# EAGLE design chromatron_v1.0 (EAGLE 6.6.0)

## Sheet 1 of 2
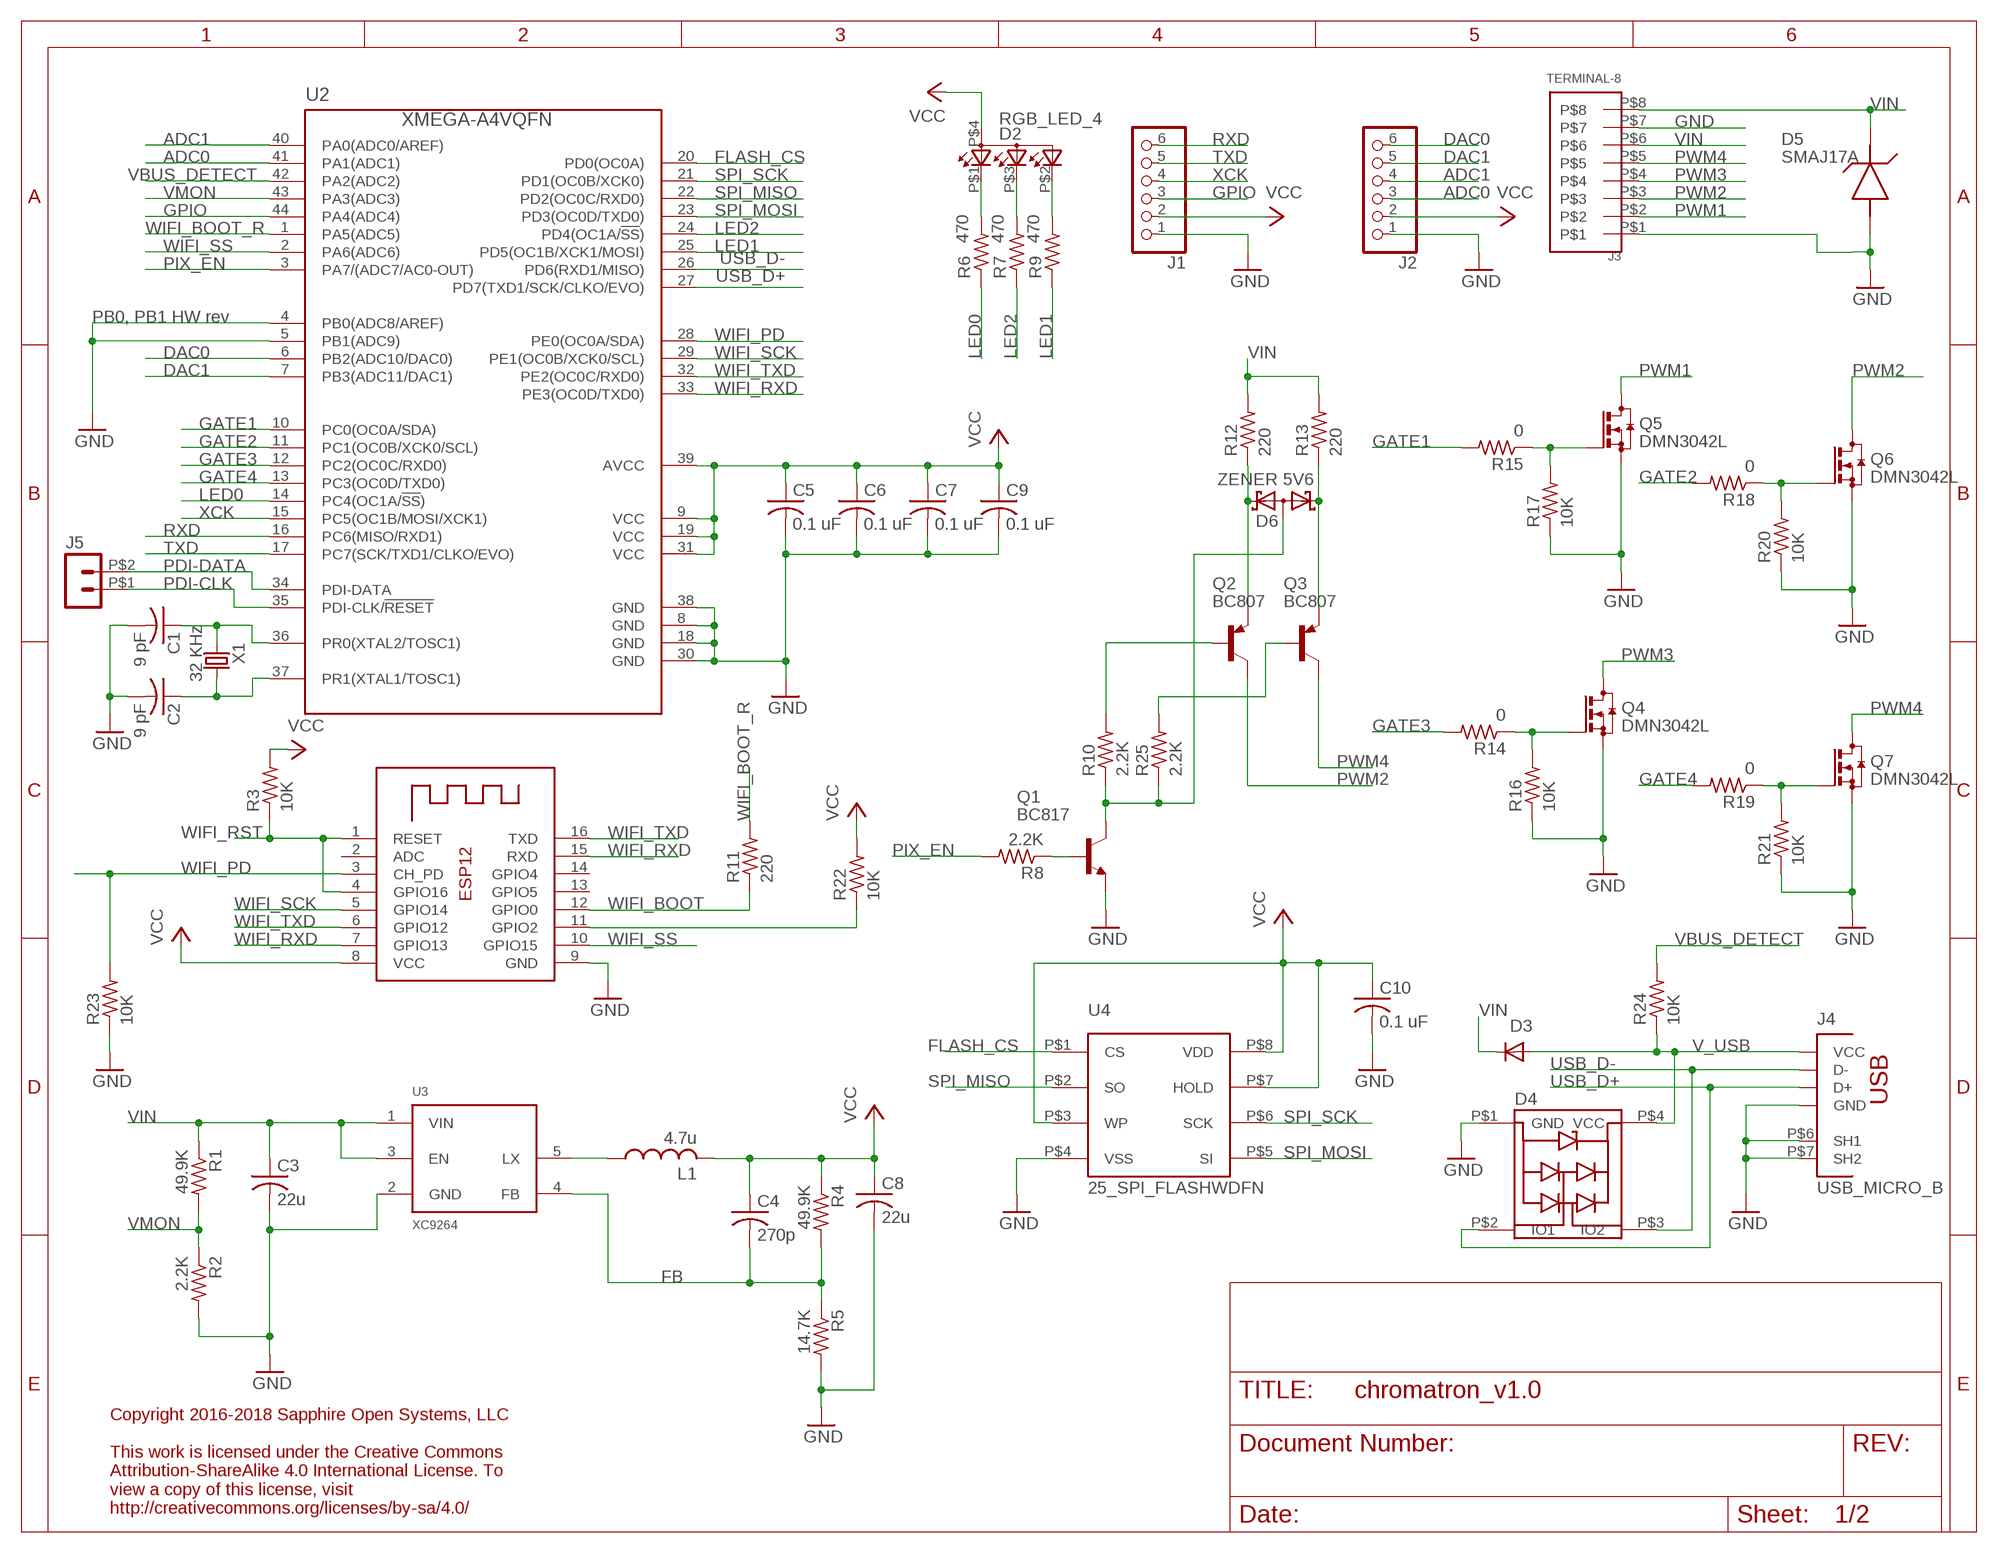
[diagram p0: schematic, sheet 1]

### Parts
C1  9 pF  C-USC0402  [C0402]
C2  9 pF  C-USC0402  [C0402]
C3  22u  C-USC1206  [C1206]
C4  270p  C-USC0402  [C0402]
C5  0.1 uF  C-USC0402  [C0402]
C6  0.1 uF  C-USC0402  [C0402]
C7  0.1 uF  C-USC0402  [C0402]
C8  22u  C-USC1206  [C1206]
C9  0.1 uF  C-USC0402  [C0402]
C10  0.1 uF  C-USC0402  [C0402]
D2  RGB_LED_4  [0606-4]
D3  2A  DIODE_SOD-123FL  [SOD-123FL]
D4  PTRTR5V0U2X  [SOT-143B]
D5  SMAJ17A  SMA_TVS  [SMA]
D6  ZENER 5V6  BAT54A  [SOT23]
J1  PINHD-1X6  [1X06]
J2  PINHD-1X6  [1X06]
J3  TERMINAL-8  [TERMINAL-8]
J4  USB_MICRO_B  [USB-MICRO-B]
J5  PIN_HEADER_1X2  [PIN_HEADER_1X2]
L1  4.7u  L-USL2012C  [L2012C]
Q1  BC817  NPN  [SOT23]
Q2  BC807  PNP  [SOT23]
Q3  BC807  PNP  [SOT23]
Q4  DMN3042L  BSS123  [SOT23]
Q5  DMN3042L  BSS123  [SOT23]
Q6  DMN3042L  BSS123  [SOT23]
Q7  DMN3042L  BSS123  [SOT23]
R1  49.9K  R-US_R0402  [R0402]
R2  2.2K  R-US_R0402  [R0402]
R3  10K  R-US_R0402  [R0402]
R4  49.9K  R-US_R0402  [R0402]
R5  14.7K  R-US_R0402  [R0402]
R6  470  R-US_R0402  [R0402]
R7  470  R-US_R0402  [R0402]
R8  2.2K  R-US_R0402  [R0402]
R9  470  R-US_R0402  [R0402]
R10  2.2K  R-US_R0402  [R0402]
R11  220  R-US_R0402  [R0402]
R12  220  R-US_R0402  [R0402]
R13  220  R-US_R0402  [R0402]
R14  0  R-US_R0402  [R0402]
R15  0  R-US_R0402  [R0402]
R16  10K  R-US_R0402  [R0402]
R17  10K  R-US_R0402  [R0402]
R18  0  R-US_R0402  [R0402]
R19  0  R-US_R0402  [R0402]
R20  10K  R-US_R0402  [R0402]
R21  10K  R-US_R0402  [R0402]
R22  10K  R-US_R0402  [R0402]
R23  10K  R-US_R0402  [R0402]
R24  10K  R-US_R0402  [R0402]
R25  2.2K  R-US_R0402  [R0402]
U1  ESP-12  [ESP-12]
U2  XMEGA-A4VQFN  [QFN44]
U3  XC9264  [SOT-25]
U4  25_SPI_FLASHWDFN  [WDFN-8]
X1  32 KHz  CRYSTAL_3.2X1.5  [XTAL_3.2X1.5]

### Nets
ADC0: J2.3 U2.41(PA1(ADC1))
ADC1: J2.4 U2.40(PA0(ADC0/AREF))
DAC0: J2.6 U2.6(PB2(ADC10/DAC0))
DAC1: J2.5 U2.7(PB3(ADC11/DAC1))
DEL: R22.1 U1.11(GPIO2)
FB: C4.2 R4.2 R5.1 U3.4(FB)
FLASH_CS: U2.20(PD0(OC0A)) U4.P$1(CS)
GATE1: R15.2 U2.10(PC0(OC0A/SDA))
GATE2: R18.2 U2.11(PC1(OC0B/XCK0/SCL))
GATE3: R14.2 U2.12(PC2(OC0C/RXD0))
GATE4: R19.2 U2.13(PC3(OC0D/TXD0))
GND: C1.2 C2.2 C3.2 C5.2 C6.2 C7.2 C8.2 C9.2 C10.2 D4.P$1(GND) D5.P$2(GND) J1.1 J2.1 J3.P$1 J3.P$7 J4.P$5(GND) J4.P$6(SH1) J4.P$7(SH2) Q1.2(E) Q4.2(S) Q5.2(S) Q6.2(S) Q7.2(S) R2.2 R5.2 R16.1 R17.1 R20.1 R21.1 R23.1 U1.9(GND) U2.4(PB0(ADC8/AREF)) U2.5(PB1(ADC9)) U2.8(GND) U2.18(GND) U2.30(GND) U2.38(GND) U3.2(GND) U4.P$4(VSS)
GPIO: J1.3 U2.44(PA4(ADC4))
LED0: R6.1 U2.14(PC4(OC1A/!SS!))
LED1: R9.1 U2.25(PD5(OC1B/XCK1/MOSI))
LED2: R7.1 U2.24(PD4(OC1A/!SS!))
LX: L1.1 U3.5(LX)
N$1: D2.P$1(CRED) R6.2
N$2: D2.P$3(CBLUE) R7.2
N$3: C1.1 U2.36(PR0(XTAL2/TOSC1)) X1.P$1
N$4: C2.1 U2.37(PR1(XTAL1/TOSC1)) X1.P$2
N$5: D2.P$2(CGREEN) R9.2
N$6: D6.2(K2) Q2.2(E) R12.1
N$7: Q3.1(B) R25.2
N$8: D6.1(K1) Q3.2(E) R13.1
N$9: Q2.1(B) R10.2
N$10: D6.3(AA) Q1.3(C) R10.1 R25.1
N$11: Q1.1(B) R8.1
N$12: Q7.1(G) R19.1 R21.2
N$13: Q6.1(G) R18.1 R20.2
N$14: Q5.1(G) R15.1 R17.2
N$15: Q4.1(G) R14.1 R16.2
PDI-CLK: J5.P$1 U2.35(PDI-CLK/!RESET)
PDI-DATA: J5.P$2 U2.34(PDI-DATA)
PIX_EN: R8.2 U2.3(PA7/(ADC7/AC0-OUT))
PWM1: J3.P$2 Q5.3(D)
PWM2: J3.P$3 Q2.3(C) Q6.3(D)
PWM3: J3.P$4 Q4.3(D)
PWM4: J3.P$5 Q3.3(C) Q7.3(D)
RXD: J1.6 U2.16(PC6(MISO/RXD1))
SPI_MISO: U2.22(PD2(OC0C/RXD0)) U4.P$2(SO)
SPI_MOSI: U2.23(PD3(OC0D/TXD0)) U4.P$5(SI)
SPI_SCK: U2.21(PD1(OC0B/XCK0)) U4.P$6(SCK)
TXD: J1.5 U2.17(PC7(SCK/TXD1/CLKO/EVO))
USB_D+: D4.P$2(IO1) J4.P$3(D+) U2.27(PD7(TXD1/SCK/CLKO/EVO))
USB_D-: D4.P$3(IO2) J4.P$2(D-) U2.26(PD6(RXD1/MISO))
V_USB: D3.A D4.P$4(VCC) J4.P$1(VCC) R24.1
VBUS_DETECT: R24.2 U2.42(PA2(ADC2))
VCC: C4.1 C5.1 C6.1 C7.1 C8.1 C9.1 C10.1 D2.P$4(A2) J1.2 J2.2 L1.2 R3.2 R4.1 R22.2 U1.8(VCC) U2.9(VCC) U2.19(VCC) U2.31(VCC) U2.39(AVCC) U4.P$3(WP) U4.P$7(HOLD) U4.P$8(VDD)
VIN: C3.1 D3.C D5.P$1(LINE) J3.P$6 J3.P$8 R1.1 R12.2 R13.2 U3.1(VIN) U3.3(EN)
VMON: R1.2 R2.1 U2.43(PA3(ADC3))
WIFI_BOOT: R11.1 U1.12(GPIO0)
WIFI_BOOT_R: R11.2 U2.1(PA5(ADC5))
WIFI_PD: R23.2 U1.3(CH_PD) U2.28(PE0(OC0A/SDA))
WIFI_RST: R3.1 U1.1(RESET) U1.4(GPIO16)
WIFI_RXD: U1.7(GPIO13) U1.15(RXD) U2.33(PE3(OC0D/TXD0))
WIFI_SCK: U1.5(GPIO14) U2.29(PE1(OC0B/XCK0/SCL))
WIFI_SS: U1.10(GPIO15) U2.2(PA6(ADC6))
WIFI_TXD: U1.6(GPIO12) U1.16(TXD) U2.32(PE2(OC0C/RXD0))
XCK: J1.4 U2.15(PC5(OC1B/MOSI/XCK1))
Unconnected: U1.2(ADC) U1.13(GPIO5) U1.14(GPIO4)

### Notes on the sheet
- PB0, PB1 HW rev
- Copyright 2016-2018 Sapphire Open Systems, LLC
  
  This work is licensed under the Creative Commons 
  Attribution-ShareAlike 4.0 International License. To 
  view a copy of this license, visit 
  http://creativecommons.org/licenses/by-sa/4.0/

## Sheet 2 of 2
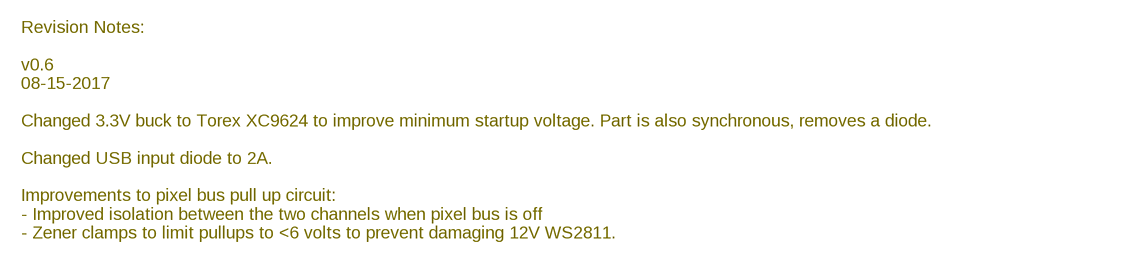
[diagram p1: schematic, sheet 2]

### Notes on the sheet
- Revision Notes:
  
  v0.6
  08-15-2017
  
  Changed 3.3V buck to Torex XC9624 to improve minimum startup voltage. Part is also synchronous, removes a diode.
  
  Changed USB input diode to 2A.
  
  Improvements to pixel bus pull up circuit:
  - Improved isolation between the two channels when pixel bus is off
  - Zener clamps to limit pullups to <6 volts to prevent damaging 12V WS2811.

## Library data of the parts
C1-C10 = rcl:C-US: CAPACITOR, American symbol
D2 = sapphire:RGB_LED_4
D3 = adafruit:DIODE: Diode SMADIODE - SMA Surface Mount Package 20V 1A Schottky Diode Digikey: 641-1014-6-ND DO-1N4148 - Through Hole Small Current Diode SOD-123 20V 1 A (.5mV Vf) Schottky Diode - Digikey: MBRX120TPMSCT-ND SOD-323 10V 570mA (.38mV Vf, 3ns) Schottky Diode - Digikey: ZLLS410CT-ND SOD-523 30V 30mA Schottky Diode (RB751S-40TE61) - Digikey: RB751S-40TE61CT-ND SOT23-R/W - SOT23 Package (R = Solder Paste/Reflow Ovens, W = Hand-Soldering) BAT54Film 40V 300mA - Digikey: 497-7162-1-ND
D4 = sapphire:PTRTR5V0U2X
D5 = sapphire:SMA_TVS
D6 = diode:BAT54A: Schottky Diodes Source: Fairchild .. BAT54.pdf
J1 J2 = adafruit:PINHD-1X6: PIN HEADER
J3 = sapphire:TERMINAL-8
J4 = jeremy:USB_MICRO_B
J5 = sapphire:PIN_HEADER_1X2
L1 = rcl:L-US: INDUCTOR, American symbol
Q1 = sapphire:NPN
Q2 Q3 = sapphire:PNP
Q4-Q7 = transistor-small-signal:BSS123: N-CHANNEL MOS FET
R1-R25 = rcl:R-US_: RESISTOR, American symbol
U1 = adafruit:ESP-12
U2 = avr-7:XMEGA-A4: Atmel XMega A4 series processor
U3 = sapphire:XC9264
U4 = sapphire:25_SPI_FLASH: Atmel AT25 series SPI dataflash / Microchip SST25 series SPI flash
X1 = sapphire:CRYSTAL_3.2X1.5

## Net classes
0 default: clearance 0.203 mm

## Board
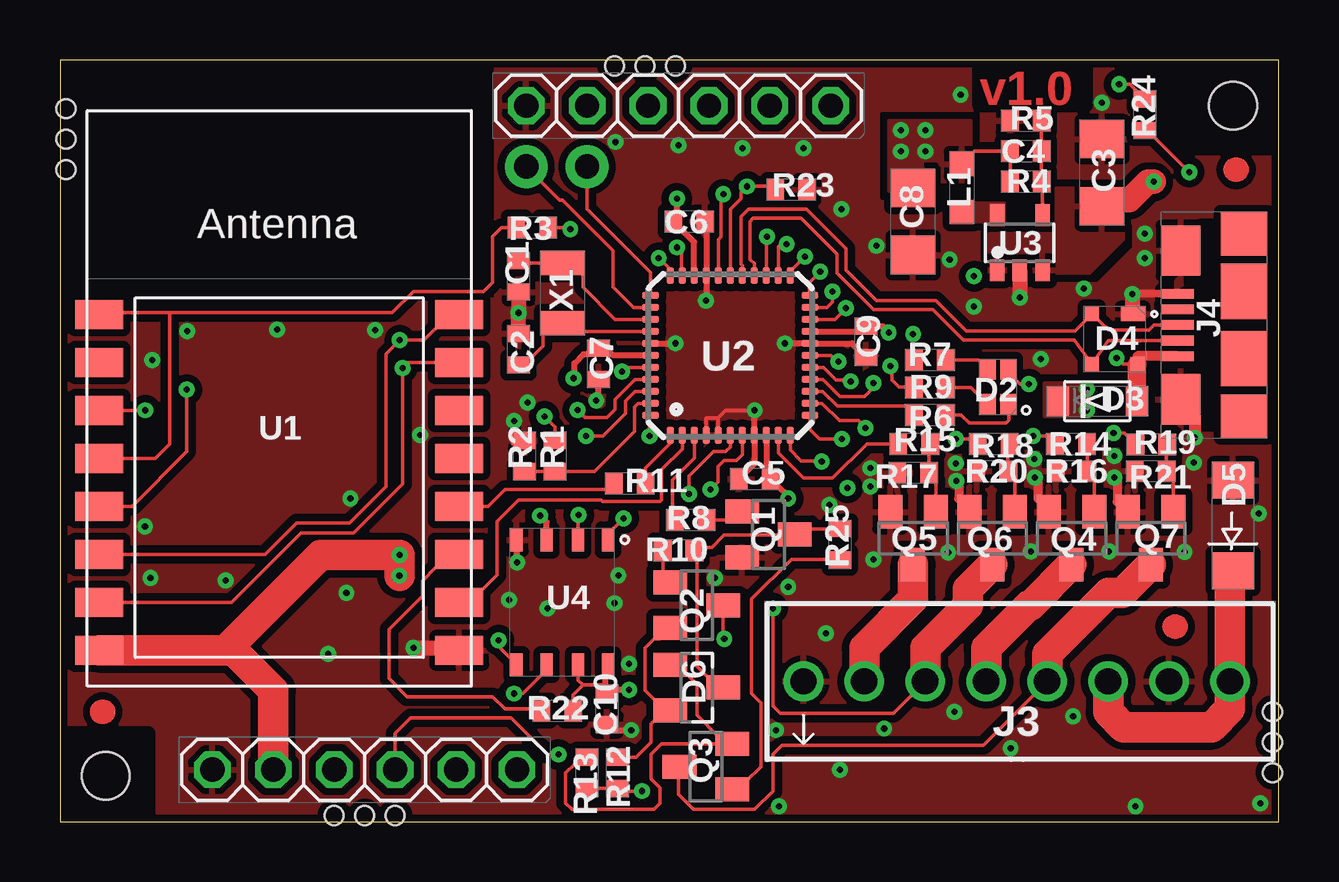
[diagram p2: board, top side]
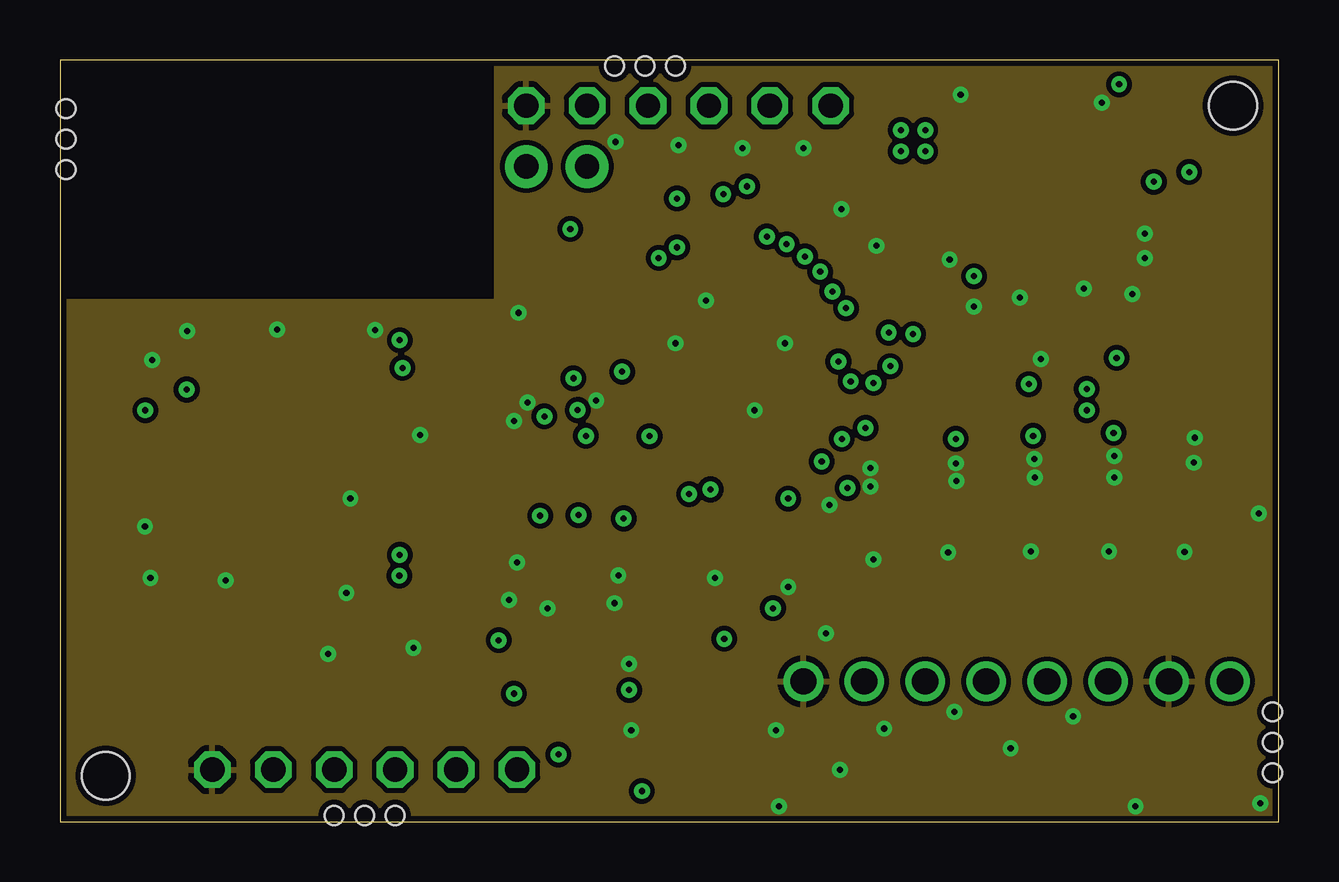
[diagram p3: board, inner layer Route2]
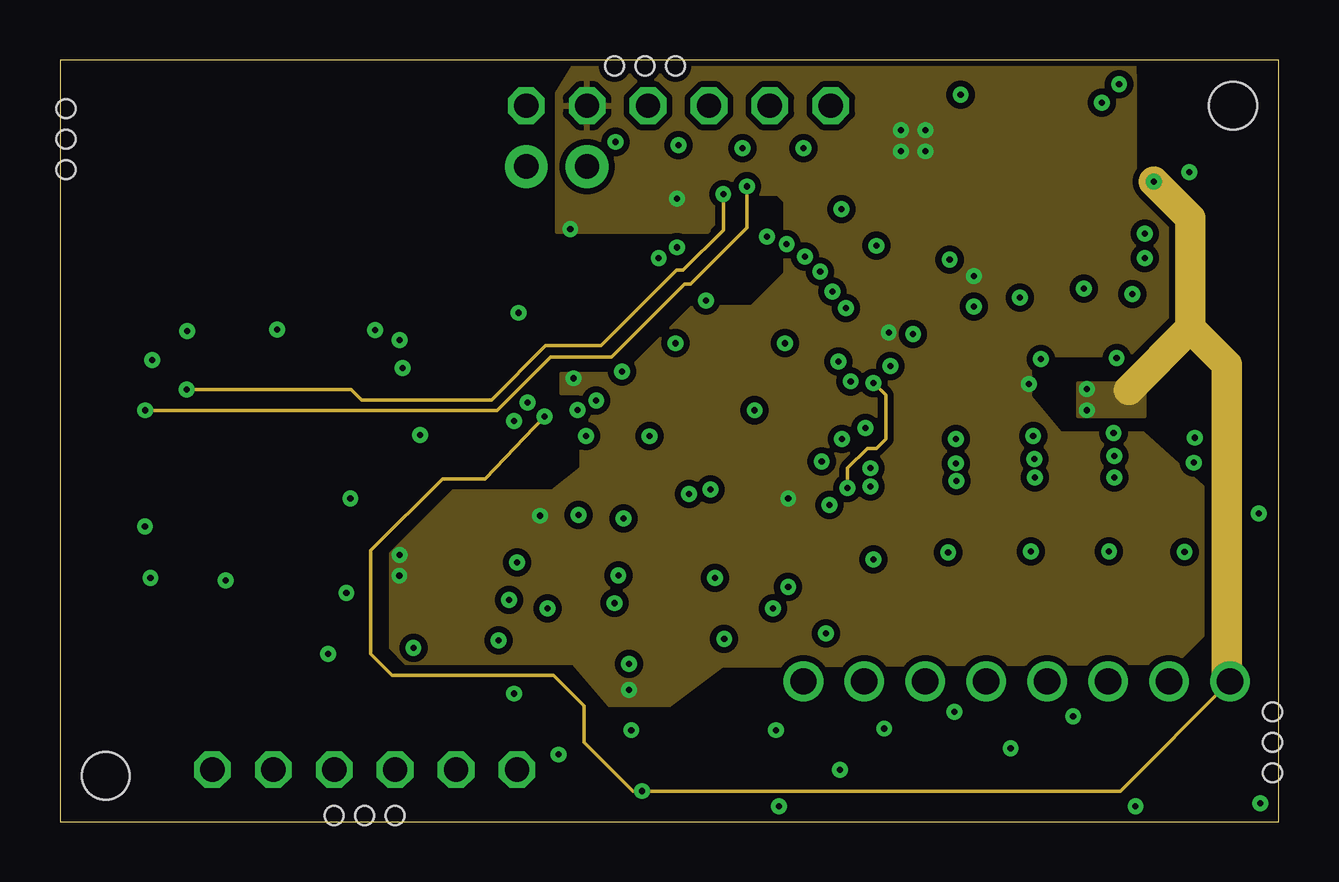
[diagram p4: board, inner layer Route15]
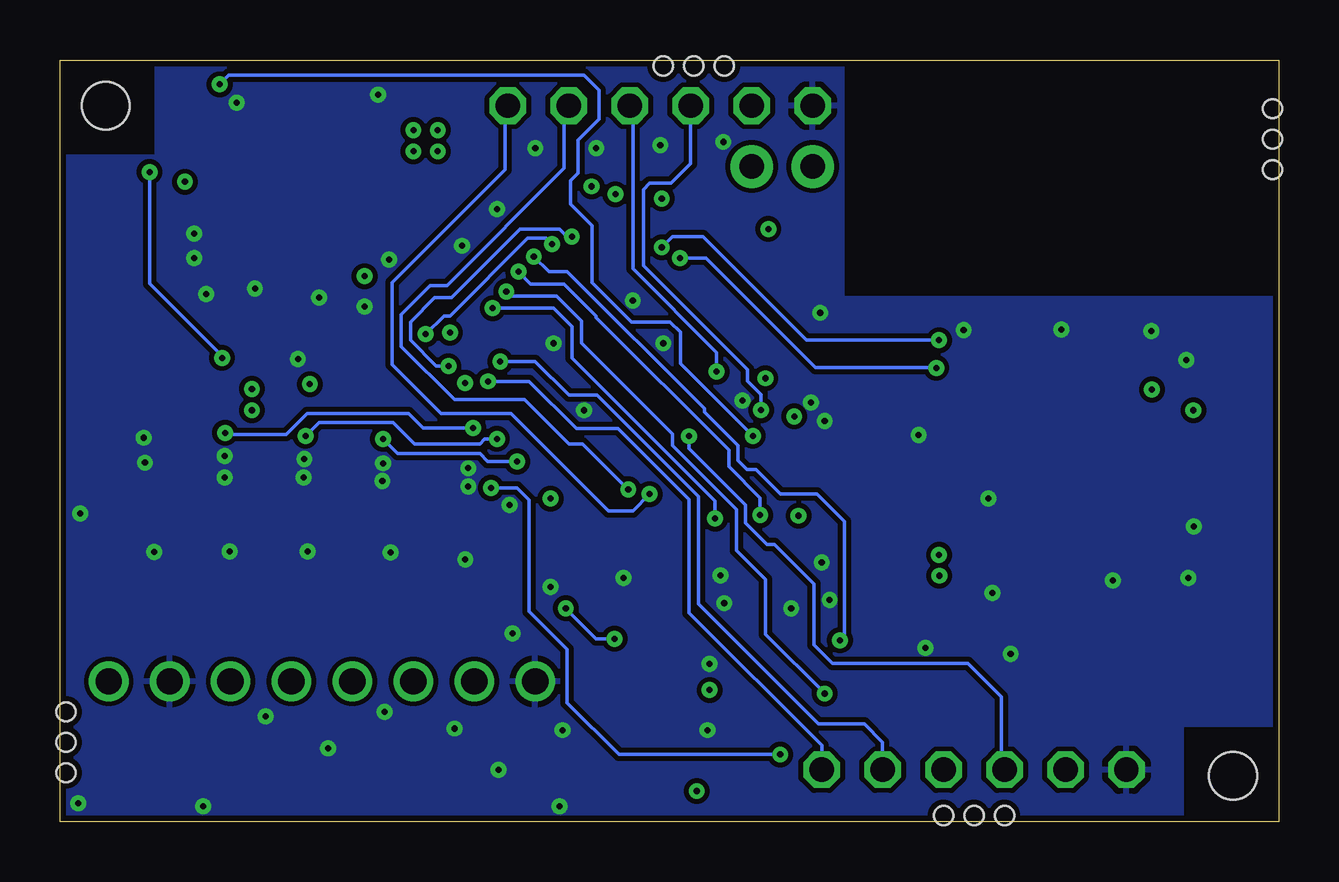
[diagram p5: board, bottom side, seen from below]

Size 50.8 x 31.75 mm. Coordinates in mm from the lower left corner, seen from the top.
Outline: 0,0 50.8,0 50.8,31.75 0,31.75 0,0
Copper layers ((1*2)+(15*16)): Top 0.035mm / dielectric 1.5mm / Route2 0.035mm / dielectric 0.15mm / Route15 0.035mm / dielectric 0.2mm / Bottom 0.035mm
Design rules "default *": minimum track width 5mil, minimum drill 10mil, track to track 5mil, track to pad 5mil, pad to pad 5mil, via to via 5mil, smd to smd 5mil, copper to edge 10mil, drill to drill 8mil, minimum pad ring 10mil, minimum via ring 8mil, stop-mask expansion 4mil, vias tented up to drill 0mil, thermal gap 10mil
Holes 2 mm at 1.91,1.91 48.9,29.84
tKeepout: area 0,0 to 0.5,27.9; area 0.5,0 to 50.8,0.5; area 50.3,0.5 to 50.8,27.9; area 0.5,31.2 to 50.3,31.8; area 50.3,27.9 to 50.8,31.8; area 0,27.9 to 0.5,31.8; area 47.1,28.1 to 50.3,31.2; area 0.5,0.5 to 3.7,3.7; area 5.9,14 to 12.9,19.5
tRestrict: area 47.1,28.1 to 50.8,31.8; area 0,0 to 3.7,3.7
bRestrict: area 0.3,0.3 to 3.9,3.9; area 46.9,27.8 to 50.5,31.5

### Footprints (pad centres in the part's own frame; a part is rotated, then mirrored left to right if it is on the bottom)
C0402 = smd 0.7 x 0.9: 1 -0.65,0; 2 0.65,0
C1206 = smd 1.6 x 1.8: 1 -1.4,0; 2 1.4,0
0606-4 = smd 0.65 x 0.85: P$1 -0.45,0.75; P$2 0.4,0.75; P$3 0.4,-0.7; P$4 -0.45,-0.7
SOD-123FL = smd 0.91 x 1.22: A 1.637,0; C -1.637,0
SOT-143B = smd 1 x 0.6: P$1 0.5,0.3 | smd 0.6 x 0.6: P$2 2.2,0.3; P$3 2.2,2.4; P$4 0.3,2.4
SMA = smd 1.524 x 1.676: P$1 -1.829,-0.051; P$2 1.93,-0.051
SOT23 = smd 1 x 1.4: 1 -0.95,-1.1; 2 0.95,-1.1; 3 0,1.1
1X06 = drill 1.016 octagon: 1 -6.35,0; 2 -3.81,0; 3 -1.27,0; 4 1.27,0; 5 3.81,0; 6 6.35,0
TERMINAL-8 = drill 1.1: P$1 -8.89,0; P$2 -6.35,0; P$3 -3.81,0; P$4 -1.27,0; P$5 1.27,0; P$6 3.81,0; P$7 6.35,0; P$8 8.89,0
USB-MICRO-B = smd 0.4 x 1.35: P$1 -1.3,2.7; P$2 -0.65,2.7; P$3 0,2.7; P$4 0.65,2.7; P$5 1.3,2.7 | smd 2.1 x 1.6: P$6 -3.1,2.55; P$7 3.1,2.55 | smd 1.8 x 1.9: P$8 -3.8,-0.05; P$9 3.8,-0.05 | smd 2.3 x 1.9: P$10 -1.4,-0.05; P$11 1.4,-0.05
PIN_HEADER_1X2 = drill 1.016 pad 1.778: P$1 -1.27,0; P$2 1.27,0
L2012C = smd 1 x 1: 1 -1,0; 2 1,0
R0402 = smd 0.7 x 0.9: 1 -0.65,0; 2 0.65,0
ESP-12 = smd 2 x 1.2: 1 -7.5,4.5; 2 -7.5,2.5; 3 -7.5,0.5; 4 -7.5,-1.5; 5 -7.5,-3.5; 6 -7.5,-5.5; 7 -7.5,-7.5; 8 -7.5,-9.5; 9 7.5,-9.5; 10 7.5,-7.5; 11 7.5,-5.5; 12 7.5,-3.5; 13 7.5,-1.5; 14 7.5,0.5; 15 7.5,2.5; 16 7.5,4.5
QFN44 = smd 0.7 x 0.3: 1 -3.325,2.5; 2 -3.325,2; 3 -3.325,1.5; 4 -3.325,1; 5 -3.325,0.5; 6 -3.325,0; 7 -3.325,-0.5; 8 -3.325,-1; 9 -3.325,-1.5; 10 -3.325,-2; 11 -3.325,-2.5; 23 3.325,-2.5; 24 3.325,-2; 25 3.325,-1.5; 26 3.325,-1; 27 3.325,-0.5; 28 3.325,0; 29 3.325,0.5; 30 3.325,1; 31 3.325,1.5; 32 3.325,2; 33 3.325,2.5 | smd 0.3 x 0.7: 12 -2.5,-3.325; 13 -2,-3.325; 14 -1.5,-3.325; 15 -1,-3.325; 16 -0.5,-3.325; 17 0,-3.325; 18 0.5,-3.325; 19 1,-3.325; 20 1.5,-3.325; 21 2,-3.325; 22 2.5,-3.325; 34 2.5,3.325; 35 2,3.325; 36 1.5,3.325; 37 1,3.325; 38 0.5,3.325; 39 0,3.325; 40 -0.5,3.325; 41 -1,3.325; 42 -1.5,3.325; 43 -2,3.325; 44 -2.5,3.325
SOT-25 = smd 0.6 x 0.9: 1 -0.95,-1.15; 2 0,-1.15; 3 0.95,-1.15; 4 0.95,1.15; 5 -0.95,1.15
WDFN-8 = smd 0.5 x 0.95: P$1 -1.95,-2.6; P$2 -0.7,-2.6; P$3 0.6,-2.6; P$4 1.85,-2.6; P$5 1.85,2.6; P$6 0.6,2.6; P$7 -0.7,2.6; P$8 -1.95,2.6
MOUSE_BITE_3X = hole 0.787: 0,0; -1.27,0; 1.27,0
XTAL_3.2X1.5 = smd 1 x 1.8: P$1 -1.2,0; P$2 1.3,0

### Placement (x,y rotation side)
C1  19.11,22.73 270 top
C2  19.11,19.68 90 top
C3  43.43,27.05 90 top
C4  40.26,27.94 0 top
C5  28.96,14.29 180 top
C6  26.23,25.02 0 top
C7  22.44,19.09 270 top
C8  35.56,25.02 270 top
C9  33.59,20 270 top
C10  22.8,4.7 270 top
D2  39.08,18.15 180 top
D3  43.24,17.53 0 top
D4  45.21,21.46 180 top
D5  48.84,12.29 90 top
D6  26.54,5.59 270 top
DRILEGEND  [DRILEGEND]  3.4,-20.91 0 top  (outside the outline)
J1  12.7,2.16 0 top
J2  25.78,29.84 0 top
J3  39.88,5.84 0 top
J4  49.28,20.7 90 top
J5  20.7,27.3 0 top
L1  37.59,26.42 90 top
Q1  29.53,11.97 270 top
Q2  26.54,9.02 270 top
Q3  26.92,2.29 90 top
Q4  42.16,11.81 180 top
Q5  35.56,11.81 180 top
Q6  38.86,11.81 180 top
Q7  45.47,11.81 180 top
R1  20.64,15.24 270 top
R2  19.37,15.24 90 top
R3  19.68,24.77 0 top
R4  40.26,26.67 0 top
R5  40.26,29.21 180 top
R6  36.26,16.95 0 top
R7  36.26,19.24 0 top
R8  26.29,12.57 180 top
R9  36.26,18.1 0 top
R10  25.78,11.3 180 top
R11  23.75,14.1 0 top
R12  23.24,2.03 270 top
R13  21.97,2.03 270 top
R14  42.14,15.75 180 top
R15  35.61,15.75 180 top
R16  42.16,14.61 0 top
R17  35.56,14.54 0 top
R18  38.91,15.75 180 top
R19  45.49,15.72 180 top
R20  38.86,14.61 0 top
R21  45.47,14.61 0 top
R22  20.73,4.62 0 top
R23  30.48,26.34 180 top
R24  45.21,29.46 90 top
R25  32.51,11.56 270 top
U1  9.14,16.64 0 top
U2  27.94,19.43 90 top
U3  40.01,24.13 0 top
U4  20.89,9.14 180 top
U$1  [SAPPHIRE_LOGO_0]  14.81,16.48 0 bottom
U$2  [SAPPHIRE_LOGO_NAME]  28.57,19.68 0 bottom
U$3  [MOUSE_BITE_3X]  50.55,3.3 270 bottom
U$4  [MOUSE_BITE_3X]  24.38,31.5 180 bottom
U$5  [MOUSE_BITE_3X]  12.7,0.25 0 bottom
U$6  [MOUSE_BITE_3X]  0.25,28.45 90 bottom
U$7  [FID040]  1.78,4.57 0 top
U$8  [FID040]  46.48,8.13 0 top
U$9  [FID040]  49.02,27.18 0 top
X1  20.95,22.09 270 top

### Tracks (layer width: path | path; a pad name or v marks a point on that pad's centre or on a via)
ADC0  (via drill 0.25 pad 0.46)
  Top 0.152: U2.41 23.97,18.43 23.14,17.6 23.14,17.17 22.81,16.84 21.89,16.84 v21.58,17.16
  Bottom 0.152: J2.3 24.51,27.43 25.34,26.61 26.23,26.61 26.48,26.35 26.48,23.18 22.15,18.85 22.15,18.36 21.58,17.79 v21.58,17.16
ADC1  (via drill 0.25 pad 0.46)
  Top 0.152: U2.40 23.61,18.93 v23.43,18.76
  Bottom 0.152: J2.4 26.92,29.84 26.92,23.05 23.43,19.56 v23.43,18.76
DAC0  (via drill 0.25 pad 0.46)
  Top 0.152: U2.6 27.94,15.62 27.75,15.43 27.24,15.43 26.23,14.41 v26.23,13.65
  Bottom 0.152: v26.23,13.65 26.92,12.95 27.94,12.95 32,17.02 34.92,17.02 36.96,19.05 36.96,22.48 32.26,27.18 32.26,29.84 J2.6
DAC1  (via drill 0.25 pad 0.46)
  Top 0.152: U2.7 28.44,15.3 28.19,15.05 27.69,15.05 27.43,14.8 27.43,14.16 v27.11,13.84
  Bottom 0.152: v27.11,13.84 29.02,15.75 29.59,15.75 31.43,17.59 34.35,17.59 36.58,19.81 36.58,21.14 35.37,22.35 34.67,22.35 29.78,27.24 29.78,29.84 J2.5
DEL
  Top 0.152: U1.11 16.11,10.6 15.68,10.6 15.11,10.03 15.11,9.4 13.72,8 13.72,5.97 14.48,5.21 18.03,5.21 18.54,4.7 20,4.7 R22.1
FB
  Top 0.152: R5.1 C4.2 R4.2 40.95,26.62 U3.4
FLASH_CS  (via drill 0.25 pad 0.46)
  Top 0.152: U4.P$1 22.86,12.01 v23.5,12.64 | U2.20 32.3,20.93 v32.77,21.4
  Bottom 0.152: v32.77,21.4 30.23,21.4 29.46,20.64 29.46,19.33 23.5,13.36 v23.5,12.64
GATE1
  Top 0.152: R15.2 33.63,15.75 32.21,14.33 30.99,14.33 29.94,15.37 U2.10
GATE2  (via drill 0.25)
  Top 0.152: R18.2 38.06,15.95 v37.34,15.95 | U2.11 30.44,15.48 30.89,15.04 31.73,15.04 v31.75,15.01
  Bottom 0.152: v37.34,15.95 36.73,15.34 33.3,15.34 32.97,15.01 v31.75,15.01
GATE3  (via drill 0.25)
  Top 0.152: R14.2 41.16,16.08 v40.56,16.08 | U2.12 31.27,16.34 31.65,15.95 v32.59,15.95
  Bottom 0.152: v40.56,16.08 40.01,16.64 36.91,16.64 36.02,15.75 33.3,15.75 33.1,15.95 v32.59,15.95
GATE4  (via drill 0.25)
  Top 0.152: R19.2 44.36,16.2 v43.92,16.2 | U2.13 31.77,17.43 32.49,16.71 33.27,16.71 v33.58,16.41
  Bottom 0.152: v43.92,16.2 43.84,16.13 41.38,16.13 40.49,17.02 36.27,17.02 35.66,16.41 v33.58,16.41
GND  (via drill 0.25 pad 0.46)
  Top 0.152: U2.5 27.43,16.83 | 27.43,16.83 27.75,17.14 v28.96,17.14 | U2.4 26.92,16.12 26.92,16.83 27.43,16.83
  Top 0.254: U2.38 v25.65,19.93 | 26.94,21.73 U2.30 26.94,24.77 C6.2 | v30.23,19.93 U2.18 33.01,19.93 C9.2 33.59,19.37 33.56,19.4 | 28.94,17.13 U2.8 28.94,14.92 C5.2 | v19.05,10.79 19.05,11.65 U4.P$4 | 33.27,19.3 33.56,19.4 | 33.56,19.4 33.64,19.43 | R2.2 18.92,15.76 v18.92,16.7 | C10.2 23.04,3.81 v23.81,3.81 | 22.35,17.68 22.44,17.77 C7.2
  Top 0.305: v25.65,19.93 v25.65,19.94 | 26.94,21.73 v26.92,21.72 | v30.23,19.93 v30.23,19.94 | 28.94,17.13 v28.96,17.14 | J4.P$5 v44.71,22 v44.7,22
  Top 0.381: v37.36,14.2 37.47,14.22 37.47,13.46 37.91,13.02 Q6.2 | v40.64,14.35 40.77,14.22 40.77,13.46 41.21,13.02 Q4.2 | v43.94,14.35 44.07,14.22 44.07,13.34 44.49,12.91 Q7.2
  Top 0.508: 47.23,16.95 47.31,16.87 v47.31,16
  Top 0.635: v14.73,7.24 16.54,7.24 U1.9 | D4.P$1 44.71,21.99 v44.7,22 | C2.2 v19.11,21.21 C1.2 | J4.P$6 47.23,16.95 | U3.2 v40.01,21.84
  other vias: 33.78,13.97 34.04,24 37.08,23.43 38.1,21.46 45.21,24.51 45.21,23.5 33.78,14.73 37.34,14.94 40.61,15.11 43.94,15.24 22.35,17.55 5.31,20.45 13.13,20.49 12.1,13.46 15.01,16.12 3.77,10.16 11.94,9.53 11.18,6.99 6.91,10.06 23.11,9.11 18.72,9.25 49.96,12.84 23.72,6.58 29.84,3.81 34.35,3.87 37.27,4.57 42.23,4.38 32.51,2.16 32.58,25.53 42.67,22.23 40.88,19.28 19.49,17.46 47.26,14.96 32.07,13.2 37.02,11.21 40.47,11.26 43.73,11.26 46.88,11.24 23.15,28.33 3.85,19.24 3.54,12.31 9.06,20.51 31.93,7.84 33.91,10.92 23.27,10.27 20.32,8.89 30.35,9.78 43.43,29.97 37.54,30.3 30.99,28.07 28.45,28.07 25.78,28.19 27.3,10.16 29.97,0.64 44.83,0.64 50.04,0.76 39.62,3.05
  pour Route2: -0.51,21.72 18.16,21.72 18.16,32.19 52.07,32.7 52.2,-1.14 -0.76,-0.89
  pour Top (isolate 0.305, rank 6): -0.51,21.78 18.16,21.78 18.16,32.58 52.07,32.77 52.07,-1.59 -0.76,-0.7
  pour Bottom: -0.51,21.84 18.16,21.84 18.16,35.18 52.07,35.37 51.94,-1.4 -0.76,-1.02
GPIO  (via drill 0.25)
  Top 0.152: U2.44 24.57,16.89 v24.57,16.07
  Bottom 0.152: v24.57,16.07 24.57,15.56 22.23,13.21 22.23,12.45 21.34,11.56 21.02,11.56 19.37,9.91 19.37,7.37 18.61,6.6 12.95,6.6 11.56,5.21 11.56,2.29 J1.3
LED0
  Top 0.152: U2.14 31.79,17.93 32.4,17.32 35.24,17.32 R6.1
LED1  (via drill 0.25)
  Top 0.152: U2.25 29.44,24.23 v29.46,24.38 | R9.1 35.48,18.11 34.97,18.11 34.67,18.41 34.67,18.92 v34.61,18.99
  Bottom 0.152: 29.59,24.51 v29.46,24.38 29.65,24.38 29.97,24.7 31.62,24.7 34.48,21.84 35.18,21.84 36.2,20.83 36.2,20.07 35.12,18.99 v34.61,18.99
LED2  (via drill 0.25 pad 0.46)
  Top 0.152: U2.24 29.94,23.97 v30.29,24.07 | v35.56,20.32 35.56,19.32 R7.1
  Bottom 0.152: v35.56,20.32 34.8,21.08 34.54,21.08 31.3,24.32 30.54,24.32 v30.29,24.07
LX
  pour Top (isolate 0.254, no thermals): 37.34,25.78 37.34,25.02 39.37,25.02 39.37,25.78
N$1
  Top 0.152: R6.2 37.55,16.95 37.9,16.61 39.42,16.61 39.55,16.74 39.55,17.38 D2.P$1
N$2
  Top 0.152: R7.2 38.29,19.24 D2.P$3
N$3
  Top 0.152: 19.11,23.37 C1.1 19.26,23.23 19.31,23.29 X1.P$1 21.32,23.23 21.79,22.76 21.79,22.28 23.14,20.93 U2.36
N$4
  Top 0.152: C2.1 19.38,19.3 19.62,19.3 20.14,19.82 20.14,20.32 20.56,20.73 X1.P$2 20.95,20.43 U2.37
N$5
  Top 0.152: R9.2 37.98,18.1 D2.P$2
N$6
  Top 0.152: R12.1 24.02,2.68 24.64,3.3 24.64,4.06 24.77,4.19 25,4.19 D6.2 25.21,4.64 24.38,5.46 24.38,7.24 24.77,7.62 25,7.62 Q2.2
N$7
  Top 0.152: 28.13,1.34 Q3.1 28.34,1.65 28.57,1.65 29.21,2.29 29.21,4.95 28.83,5.33 28.83,9.27 30.48,10.92 32.5,10.92 R25.2
N$8
  Top 0.152: R13.1 21.7,2.41 21.46,2.41 21.08,2.03 21.08,0.76 21.34,0.51 24.77,0.51 25.02,0.76 25.02,1.4 24.64,1.78 24.64,2.79 25.08,3.24 Q3.2 27.7,3.56 27.43,3.56 26.54,4.45 26.54,5.71 25.72,6.54 D6.1
N$9
  Top 0.152: R10.2 25.13,10.28 Q2.1
N$10
  Top 0.152: R25.1 30.87,12.21 Q1.3 30.51,11.97 30.35,11.81 30.35,11.94 27.69,11.94 27.18,11.43 26.56,11.43 R10.1 26.54,11.19 26.54,6.48 27.43,5.59 D6.3
N$11
  Top 0.152: R8.1 28.09,12.57 Q1.1
N$12
  Top 0.152: R19.1 46.12,15.7 R21.2 46.42,14.3 Q7.1
N$13
  Top 0.152: R18.1 39.51,15.7 R20.2 39.81,14.3 Q6.1
N$14
  Top 0.152: Q5.1 36.51,14.24 R17.2 36.21,15.7 R15.1
N$15
  Top 0.152: Q4.1 43.11,14.3 R16.2 42.81,15.72 R14.1
PDI-CLK
  Top 0.152: U2.35 23.91,21.43 23.05,22.29 23.05,23.81 20.95,25.91 20.83,25.91 J5.P$1
PDI-DATA
  Top 0.152: U2.34 24.61,22.88 21.97,25.53 J5.P$2
PIX_EN
  Top 0.152: U2.3 26.44,15.16 25.53,14.25 25.53,12.69 R8.2
PWM1
  Top 1.27: Q5.3 35.56,9.27 33.53,7.24 J3.P$2
PWM2  (via drill 0.25)
  Top 0.152: J3.P$3 34.73,4.51 30.04,4.51 29.72,4.83 v29.72,8.89 | v27.69,7.62 27.64,7.66 Q2.3
  Top 1.27: Q6.3 37.85,9.7 37.85,9.02 36.07,7.24 J3.P$3
  Bottom 0.152: v29.72,8.89 28.45,7.62 v27.69,7.62
PWM3
  Top 1.27: Q4.3 40.47,9.02 40.39,9.02 38.61,7.24 J3.P$4
PWM4
  Top 0.152: Q3.3 25.78,2.24 25.78,1.14 26.42,0.51 28.96,0.51 29.72,1.27 29.72,2.79 30.1,3.17 38.48,3.17 J3.P$5
  Top 1.27: Q7.3 44.28,9.53 43.69,9.53 41.15,6.99 J3.P$5
RXD  (via drill 0.25 pad 0.46)
  Top 0.152: U2.16 31.83,18.93 32.35,18.41 32.83,18.41 v32.96,18.35
  Bottom 0.152: v32.96,18.35 31.24,18.35 29.27,16.38 27.53,16.38 24.57,13.42 24.57,8.7 19.05,3.17 J1.6
SPI_MISO  (via drill 0.25, 0.25 pad 0.46)
  Top 0.152: v31.69,22.92 31.24,22.48 31.24,21.95 U2.22 | 21.59,11.87 U4.P$2 21.59,12.75 v21.61,12.78
  Bottom 0.152: v31.69,22.92 31.18,22.42 29.78,22.42 28.45,21.08 28.45,21.02 22.92,15.49 22.92,14.8 21.61,13.49 v21.61,12.78
SPI_MOSI  (via drill 0.25, 0.25 pad 0.46)
  Top 0.152: U4.P$5 19.18,6.58 18.99,6.39 | U4.P$5 19.02,6.53 | U2.23 30.44,22.95 v31.05,23.56 | v18.29,7.56 18.29,7.3 U4.P$5
  Bottom 0.152: v31.05,23.56 30.42,22.92 29.65,22.92 23.94,17.21 23.94,17.08 22.54,15.68 22.54,15.05 22.16,14.67 21.78,14.67 20.78,13.66 19.25,13.66 18.1,12.51 18.1,7.75 v18.29,7.56
SPI_SCK  (via drill 0.25, 0.25 pad 0.46)
  Top 0.152: U2.21 31.97,21.43 32.19,21.65 v32.19,22.1 | 20.31,6.83 20.31,6.57 U4.P$6 20.29,6.32 19.3,5.33 v18.92,5.33
  Bottom 0.152: v32.19,22.1 32.07,21.91 30.1,21.91 29.06,20.87 29.06,19.95 25.27,16.15 25.27,15.68 22.61,13.02 22.61,11.3 21.4,10.1 21.4,7.81 v18.92,5.33
TXD  (via drill 0.25 pad 0.46)
  Top 0.152: v32.45,19.18 32.38,19.18 32.13,19.43 U2.17
  Bottom 0.152: v32.45,19.18 30.99,19.18 29.59,17.78 28.42,17.78 24.19,13.55 24.19,9.08 19.18,4.06 17.27,4.06 16.51,3.3 J1.5
USB_D+
  Top 0.152: J4.P$3 45.59,20.7 45.39,20.5 43.71,20.5 D4.P$2 42.3,20.45 37.78,20.45 36.51,21.72 34.04,21.72 32.77,22.99 32.77,23.88 31.11,25.53 28.7,25.53 28.38,25.21 28.38,23.24 28.44,23.19 U2.27
USB_D-
  Top 0.152: J4.P$2 43.71,20.05 D4.P$3 42.29,20.07 37.66,20.07 36.39,21.34 33.91,21.34 32.38,22.86 32.38,23.65 30.89,25.15 28.89,25.15 28.77,25.02 28.77,23.43 28.94,23.26 U2.26
V_USB  (via drill 0.25)
  Top 0.152: v44.04,19.33 44.31,19.06 D4.P$4 | v47.07,27.08 45.33,28.81 R24.1
  Top 0.406: J4.P$1 44.91,19.4 D4.P$4 44.89,19.26
  Top 0.762: D4.P$4 44.88,19.03 D3.A
  Bottom 0.152: v47.07,27.08 47.07,22.43 44.04,19.41 v44.04,19.33
VBUS_DETECT  (via drill 0.25)
  Top 0.152: U2.42 24.13,17.93 23.98,17.93 23.57,17.53 23.57,17.02 22.63,16.08 v21.92,16.08 | v44.15,30.73 44.59,30.73 R24.2
  Bottom 0.152: v21.92,16.08 24.94,19.1 24.94,20.4 25.38,20.83 26.98,20.83 28.63,22.48 28.63,24.84 29.52,25.73 29.52,26.72 29.21,27.03 29.21,28.4 28.32,29.29 28.32,30.48 28.96,31.11 43.76,31.11 v44.15,30.73
VCC  (via drill 0.25, 0.25 pad 0.46)
  Top 0.152: D2.P$4 39.53,18.71 40.01,18.24 v40.39,18.24 | 21.59,6.67 21.59,5.89 21.79,5.69 | 21.79,5.69 22.75,5.69 | 22.86,5.49 22.86,5.41 C10.1 22.53,5.08 | C6.1 25.58,25.07 25.72,25.21 | R3.2 21.08,24.77 v21.27,24.7 | R22.2 21.38,5.27 21.79,5.69 | R4.1 C4.1 38.12,27.94 L1.2
  Top 0.254: 20.32,11.66 U4.P$3 20.29,12.47 v20.02,12.75 | 22.86,6.47 U4.P$8 22.75,6.35 22.75,5.69 22.75,5.54 22.8,5.49 22.86,5.49 v23.72,5.49 | v30.35,13.46 30.35,13.6 C5.1 29.44,14.52 U2.9 | U2.31 26.43,22.78 26.43,24.17 C6.1 | U2.19 33.43,20.43 C9.1 34.3,20.65 v34.54,20.38 | U2.39 23.06,19.43 22.75,19.74 C7.1 22.23,19.74 21.97,19.48 21.82,19.48 21.44,19.1 21.44,18.52 v21.4,18.48 | U4.P$7 21.59,6.67 | 25.72,25.21 v25.72,25.97
  Top 1.27: U1.8 6.88,7.14 7.05,7.3 | 7.05,7.3 10.86,11.11 v14.16,11.11 14.16,10.26 v14.15,10.25 | J1.2 8.89,5.46 7.05,7.3
  Route15 0.152: v40.39,18.24 40.39,17.98
  other vias: 36.07,28.83 36.07,27.94 35.05,28.83 35.05,27.94 38.1,22.73
  pour Top (isolate 0.254, no thermals): 35.94,28.96 35.94,26.29 34.54,26.29 34.54,28.96
  pour Route15 (isolate 0.254): 20.7,30.35 20.7,24.57 27.05,24.57 27.05,24.7 28.51,26.16 29.91,26.16 30.23,25.84 30.23,22.86 28.83,21.46 26.35,21.46 23.56,18.67 20.89,18.67 20.89,17.84 21.72,17.84 21.72,14.73 20.51,13.78 16.38,13.78 13.78,11.18 13.78,7.24 14.41,6.6 21.39,6.6 22.89,4.85 25.43,4.85 27.58,6.48 46.48,6.6 47.62,7.75 47.62,13.97 45.15,16.19 41.72,16.19 40.45,17.72 40.45,18.86 41.02,19.43 44.58,19.43 46.23,21.08 46.23,24.83 44.83,26.23 44.83,30.92 44.77,32.38 21.72,32
  pour Top (isolate 0.254, no thermals): 36.58,29.21 36.58,27.56 34.54,27.56 34.54,29.21
  pour Top: 34.67,26.67 37.97,26.67 37.97,27.94 37.97,29.21 34.54,29.21 34.54,26.67
VIN  (via drill 0.25, 0.25 pad 0.46)
  Top 0.152: R1.1 20.64,16.45 v20.19,16.89 | R13.2 R12.2 23.35,1.27 v24.26,1.27
  Top 0.635: v45.59,26.68 v45.59,26.67
  Top 1.016: C3.1 43.69,25.91 44.58,25.91 45.34,26.67 v45.59,26.67
  Top 1.27: J3.P$6 43.69,4.57 44.32,3.94 48.01,3.94 48.77,4.7 J3.P$8 48.77,10.46 D5.P$1
  Route15 0.152: 48.7,7.57 48.64,5.84 J3.P$8 44.2,1.27 v24.26,1.27 23.88,1.27 21.84,3.3 21.84,4.83 20.57,6.1 13.84,6.1 12.95,6.99 12.95,11.3 15.94,14.29 17.72,14.29 v20.19,16.89
  Route15 1.27: v45.59,26.67 47.12,25.15 47.12,20.57 | 47.12,20.57 44.55,17.98 | 48.64,5.84 48.64,19.05 47.12,20.57
  other vias: 42.8,18.03 42.8,17.14
  pour Top (no thermals): 41.02,18.29 41.02,16.89 42.93,16.89 42.93,18.29
  pour Top: 38.73,22.86 38.73,24.51 41.4,24.51 41.53,24.89 41.53,26.42 44.32,26.42 44.32,24.26 42.93,22.86
  pour Route15: 42.42,18.29 45.21,18.29 45.21,16.89 42.42,16.89
VMON
  Top 0.152: R2.1 R1.2 22.27,14.59 23.94,16.26 23.94,17.27 24.1,17.43 U2.43
WIFI_BOOT
  Top 0.152: U1.12 17.84,13.14 18.54,13.84 22.84,13.84 R11.1
WIFI_BOOT_R
  Top 0.152: U2.1 25.44,15.79 24.4,14.75 R11.2
WIFI_PD  (via drill 0.25 pad 0.46)
  Top 0.152: U1.3 3.55,17.14 v3.56,17.14 | U2.28 27.94,25.53 28.38,25.97 28.38,26.23 v28.64,26.48 29.69,26.48 R23.2
  Route15 0.152: v3.56,17.14 18.22,17.14 20.45,19.37 22.99,19.37 26.04,22.42 26.29,22.42 28.64,24.77 v28.64,26.48
WIFI_RST
  Top 0.152: 4.57,21.21 13.84,21.21 14.73,22.1 17.65,22.1 18.03,22.48 18.03,24.38 18.41,24.77 R3.1 | 4.57,21.21 1.72,21.21 U1.1 | U1.4 3.96,15.14 4.57,15.75 4.57,21.21
WIFI_RXD  (via drill 0.25 pad 0.46)
  Top 0.152: U1.15 14.5,19.14 v14.28,18.91 14.28,14.07 12.24,12.04 10.06,12.04 7.16,9.14 U1.7 | U2.33 25.4,22.8 25.4,23.05 v24.96,23.5
  Bottom 0.152: v24.96,23.5 23.88,23.5 19.3,18.92 14.29,18.92 v14.28,18.91
WIFI_SCK  (via drill 0.25)
  Top 0.152: U2.29 27.44,24.27 27.56,24.38 27.56,26.06 v27.65,26.15 | U1.5 3,13.14 5.28,15.42 v5.28,18.01
  Route15 0.152: v5.28,18.01 12.14,18.01 12.57,17.58 17.98,17.58 20.24,19.84 22.55,19.84 25.7,22.99 25.97,22.99 27.65,24.66 v27.65,26.15
WIFI_SS
  Top 0.152: U2.2 25.94,15.53 25.08,14.67 25.08,13.4 25.02,13.34 22.61,13.34 22.54,13.4 19.11,13.4 18.22,12.51 18.22,10.29 17.07,9.14 U1.10
WIFI_TXD  (via drill 0.25 pad 0.46)
  Top 0.152: U2.32 25.91,22.79 25.91,23.81 v25.72,23.94 | U1.16 16.14,20.64 15.75,20.64 15.18,20.07 v14.16,20.07 13.59,19.49 13.59,13.97 12.06,12.45 9.86,12.45 8.55,11.14 U1.6
  Bottom 0.152: v25.72,23.94 25.27,24.38 24,24.38 19.68,20.07 v14.16,20.07
XCK  (via drill 0.25)
  Top 0.152: U2.15 31.8,18.43 32.51,17.72 33.53,17.72 33.91,18.1 v33.91,18.29 | v20.78,2.79 20.32,2.79 18.8,4.32 14.61,4.32 13.97,3.68 J1.4
  Route15 0.152: v32.83,13.91 32.83,14.73 33.66,15.56 34.04,15.56 34.42,15.94 34.42,17.78 v33.91,18.29
  Bottom 0.152: v20.78,2.79 27.5,2.79 29.65,4.95 29.65,7.18 31.24,8.76 31.24,13.4 31.75,13.91 v32.83,13.91

### Text on the board
Top: v1.0
tNames: U3 | J3
tDocu: Chromatron v1.0 Assembly Drawing
Silk: Chromatron | 2 | 4 | 1 | CK | 3 | DA | + | +
bSilk: GND | ADC0 | ADC1 | DAC1 | DAC0 | 3.3V | Chromatron | CLK | DATA | GND | 3.3V | GPIO | XCK | TXD | RXD | 1 | 2 | 3 | 4 | GND | PWM | V+ | GND | V+
LPC17xx: This work is licensed under the Creative Commons / Attribution-ShareAlike 4.0 International License. To / view a copy of this license, visit / http://creativecommons.org/licenses/by-sa/4.0/
FabDrawing: Holes for mousebites / 4 locations | Chromatron v1.0 / / Copyright 2016-2018 Sapphire Open Systems, LLC / / J. Billheimer / 9-29-2017 / / This work is licensed under the Creative Commons / Attribution-ShareAlike 4.0 International License. To / view a copy of this license, visit / http://creativecommons.org/licenses/by-sa/4.0/
Panel: Fiducial mark / 3 places | Break off tabs / 4 places | Chromatron v1.0 / Panel Drawing / / 2x5 array / / Copyright 2016-2017 Sapphire Open Systems, LLC / / J. Billheimer / 9-29-2017